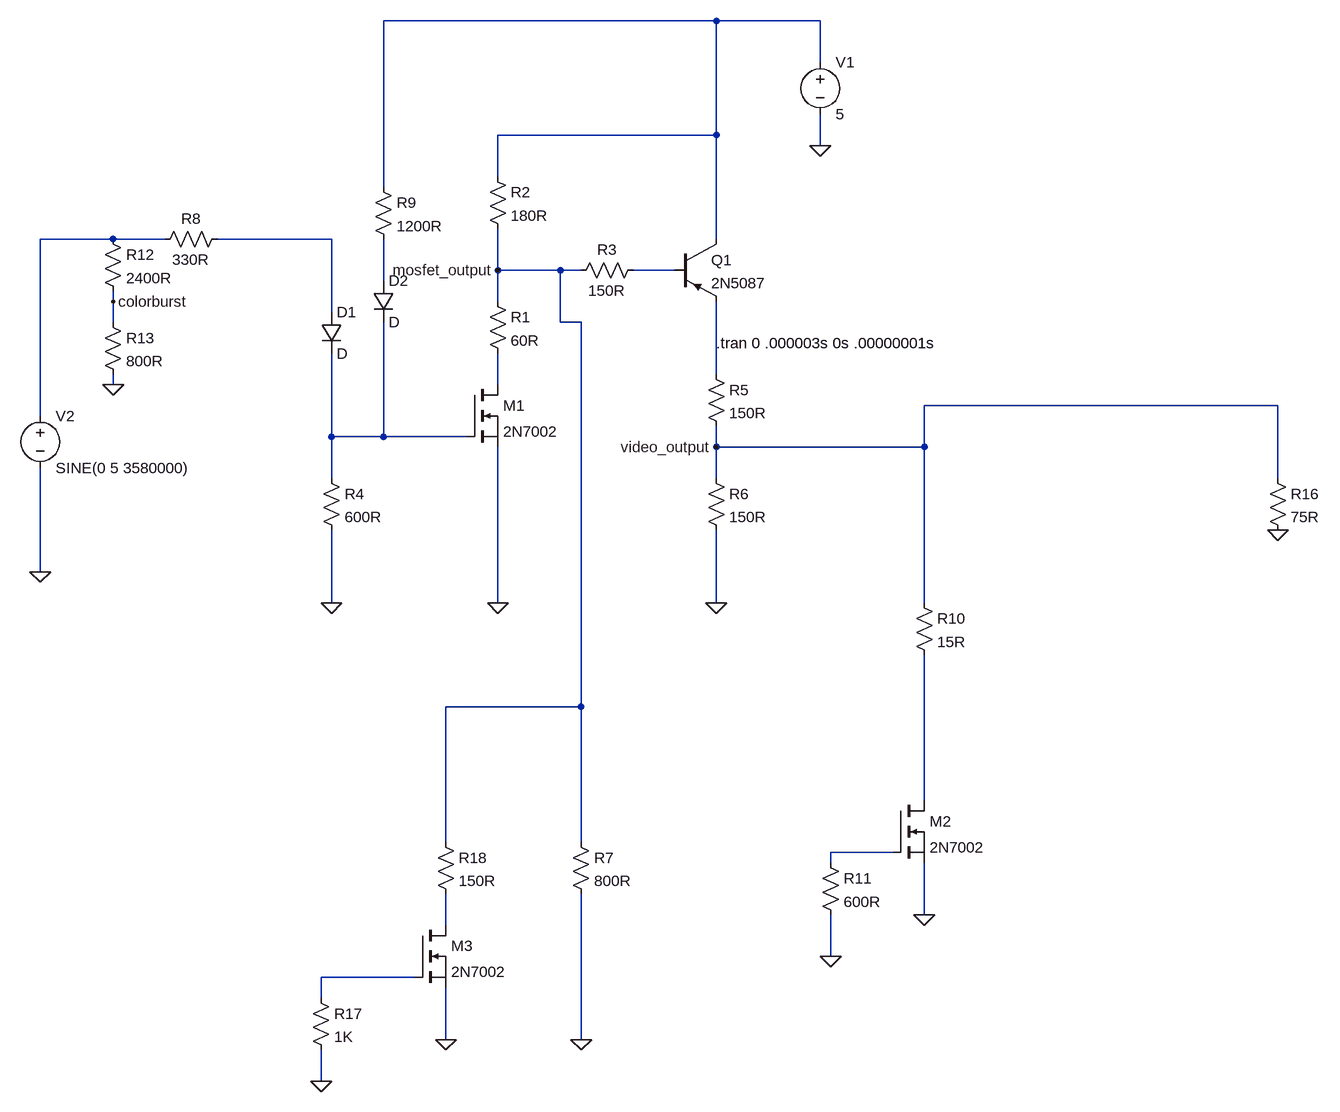
[diagram p0: schematic video_output_amplifier.asc]
video_output_amplifier.asc, the LTspice schematic file:
Version 4.1
SHEET 1 1524 1172
WIRE 592 -480 80 -480
WIRE 752 -480 592 -480
WIRE 752 -416 752 -480
WIRE 592 -304 592 -480
WIRE 592 -304 256 -304
WIRE 752 -288 752 -336
WIRE 256 -240 256 -304
WIRE 80 -224 80 -480
WIRE -336 -144 -448 -144
WIRE -256 -144 -336 -144
WIRE 0 -144 -176 -144
WIRE 592 -144 592 -304
WIRE 256 -96 256 -160
WIRE 352 -96 256 -96
WIRE 384 -96 352 -96
WIRE 528 -96 464 -96
WIRE 80 -80 80 -144
WIRE -336 -48 -336 -64
WIRE 256 -48 256 -96
WIRE 0 -32 0 -144
WIRE -336 -16 -336 -48
WIRE 352 -16 352 -96
WIRE 384 -16 352 -16
WIRE 592 64 592 -48
WIRE -336 80 -336 64
WIRE 256 80 256 32
WIRE 1456 112 912 112
WIRE -448 128 -448 -144
WIRE 0 160 0 32
WIRE 80 160 80 -16
WIRE 80 160 0 160
WIRE 208 160 80 160
WIRE 592 176 592 144
WIRE 912 176 912 112
WIRE 912 176 592 176
WIRE 0 224 0 160
WIRE 592 224 592 176
WIRE 1456 224 1456 112
WIRE -448 368 -448 208
WIRE 0 416 0 304
WIRE 256 416 256 176
WIRE 592 416 592 304
WIRE 912 416 912 176
WIRE 384 576 384 -16
WIRE 384 576 176 576
WIRE 912 720 912 496
WIRE 176 784 176 576
WIRE 384 784 384 576
WIRE 864 800 768 800
WIRE 768 816 768 800
WIRE 912 896 912 816
WIRE 176 912 176 864
WIRE 768 960 768 896
WIRE 128 992 -16 992
WIRE -16 1024 -16 992
WIRE 176 1088 176 1008
WIRE 384 1088 384 864
WIRE -16 1152 -16 1104
FLAG 752 -288 0
FLAG 592 416 0
FLAG 256 416 0
FLAG 0 416 0
FLAG 384 1088 0
FLAG -448 368 0
FLAG 592 176 video_output
FLAG 256 -96 mosfet_output
FLAG 912 896 0
FLAG 768 960 0
FLAG -336 -48 colorburst
FLAG -336 80 0
FLAG 1456 304 0
FLAG 176 1088 0
FLAG -16 1152 0
SYMBOL nmos 208 80 R0
SYMATTR InstName M1
SYMATTR Value 2N7002
SYMBOL pnp 528 -144 R0
SYMATTR InstName Q1
SYMATTR Value 2N5087
SYMBOL res 240 -64 R0
SYMATTR InstName R1
SYMATTR Value 60R
SYMBOL res 240 -256 R0
SYMATTR InstName R2
SYMATTR Value 180R
SYMBOL res 480 -112 R90
WINDOW 0 0 56 VBottom 2
WINDOW 3 32 56 VTop 2
SYMATTR InstName R3
SYMATTR Value 150R
SYMBOL res -16 208 R0
SYMATTR InstName R4
SYMATTR Value 600R
SYMBOL res 576 48 R0
SYMATTR InstName R5
SYMATTR Value 150R
SYMBOL res 576 208 R0
SYMATTR InstName R6
SYMATTR Value 150R
SYMBOL voltage 752 -432 R0
WINDOW 123 0 0 Left 0
WINDOW 39 0 0 Left 0
SYMATTR InstName V1
SYMATTR Value 5
SYMBOL res 368 768 R0
SYMATTR InstName R7
SYMATTR Value 800R
SYMBOL voltage -448 112 R0
WINDOW 123 0 0 Left 0
WINDOW 39 0 0 Left 0
SYMATTR InstName V2
SYMATTR Value SINE(0 5 3580000)
SYMBOL diode -16 -32 R0
SYMATTR InstName D1
SYMBOL res -160 -160 R90
WINDOW 0 0 56 VBottom 2
WINDOW 3 32 56 VTop 2
SYMATTR InstName R8
SYMATTR Value 330R
SYMBOL diode 64 -80 R0
SYMATTR InstName D2
SYMBOL res 64 -240 R0
SYMATTR InstName R9
SYMATTR Value 1200R
SYMBOL nmos 864 720 R0
SYMATTR InstName M2
SYMATTR Value 2N7002
SYMBOL res 896 400 R0
SYMATTR InstName R10
SYMATTR Value 15R
SYMBOL res 752 800 R0
SYMATTR InstName R11
SYMATTR Value 600R
SYMBOL res -352 -160 R0
SYMATTR InstName R12
SYMATTR Value 2400R
SYMBOL res -352 -32 R0
SYMATTR InstName R13
SYMATTR Value 800R
SYMBOL res 1440 208 R0
SYMATTR InstName R16
SYMATTR Value 75R
SYMBOL nmos 128 912 R0
SYMATTR InstName M3
SYMATTR Value 2N7002
SYMBOL res -32 1008 R0
SYMATTR InstName R17
SYMATTR Value 1K
SYMBOL res 160 768 R0
SYMATTR InstName R18
SYMATTR Value 150R
TEXT 592 16 Left 2 !.tran 0 .000003s 0s .00000001s

The netlist it stands for:
* video_output_amplifier.asc
M1 N007 N008 0 0 2N7002
Q1 N001 N004 N006 0 2N5087
R1 mosfet_output N007 60R
R2 N001 mosfet_output 180R
R3 N004 mosfet_output 150R
R4 N008 0 600R
R5 N006 video_output 150R
R6 video_output 0 150R
V1 N001 0 5
R7 mosfet_output 0 800R
V2 N002 0 SINE(0 5 3580000)
D1 N003 N008 D
R8 N003 N002 330R
D2 N005 N008 D
R9 N001 N005 1200R
M2 N009 N010 0 0 2N7002
R10 video_output N009 15R
R11 N010 0 600R
R12 N002 colorburst 2400R
R13 colorburst 0 800R
R16 video_output 0 75R
M3 N011 N012 0 0 2N7002
R17 N012 0 1K
R18 mosfet_output N011 150R
.model D D
.lib standard.dio
.model NPN NPN
.model PNP PNP
.lib standard.bjt
.model NMOS NMOS
.model PMOS PMOS
.lib standard.mos
.tran 0 .000003s 0s .00000001s
.backanno
.end